# Altium project OpAmpDiffHSC.PRJPCB
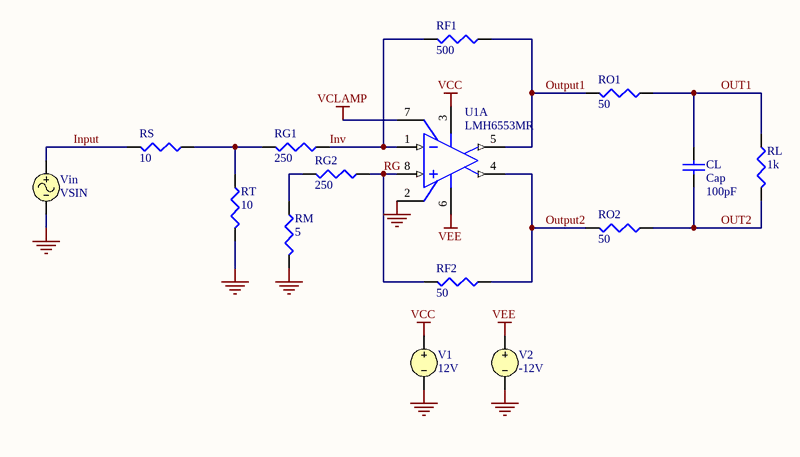
[diagram p0: OpAmpDiffHSC.schdoc]
1 sheet, 15 parts. Net scope: global (net labels, ports and power ports of the same name join across sheets).

## Sheet OpAmpDiffHSC.schdoc: Analog Amplifier
size A4; Organization: Altium Limited; Address1: L3, 12a Rodborough Rd; Address2: Frenchs Forest; Address3: NSW; Address4: Australia 2086; DocumentNumber: 1; SheetNumber: 1; SheetTotal: 1

### Parts
CL  Cap  value 100pF  [RAD-0.3]
RF1  value 500  (hidden comment: 100k)
RF2  value 50  (hidden comment: 100k)
RG1  value 250  (hidden comment: 10k)
RG2  value 250  (hidden comment: 10k)
RL  value 1k  (hidden comment: 25k)
RM  value 5  (hidden comment: 10k)
RO1  value 50  (hidden comment: 25k)
RO2  value 50  (hidden comment: 25k)
RS  value 10  (hidden comment: 10k)
RT  value 10  (hidden comment: 10k)
U1  LMH6553MR  [MRA08B_N]  (part A of 2)
V1  12V
V2  -12V
Vin  VSIN

### Nets
GND: RM.1(TOP) RT.1(TOP) U1.2(VCM) V1.2 V2.2 Vin.2
VCC: U1.3(V+) V1.1
VCLAMP: U1.7(VCLAMP)
VEE: U1.6(V-) V2.1
Input: RS.1(TOP) Vin.1
Inv: RF1.1(TOP) RG1.2(BOT) U1.1(IN-)
OUT1: CL.2 RL.2(BOT) RO1.2(BOT)
OUT2: CL.1 RL.1(TOP) RO2.2(BOT)
Output1: RF1.2(BOT) RO1.1(TOP) U1.5(OUT-)
Output2: RF2.2(BOT) RO2.1(TOP) U1.4(OUT+)
RG: RF2.1(TOP) RG2.2(BOT) U1.8(IN+)
NetRG1_1: RG1.1(TOP) RS.2(BOT) RT.2(BOT)
NetRG2_1: RG2.1(TOP) RM.2(BOT)

### Notes on the sheet
- Title
- Size:
- Date:
- A4
- Number:
- Time:
- Revision:
- Sheet
- of
- File:

### Library data of the parts
CL = Cap: Capacitor; Published: 8-Jun-2000; LatestRevisionDate: 17-Jul-2002; LatestRevisionNote: Re-released for DXP Platform.; PackageReference: RAD-0.3; Publisher: Altium Limited
RF1 RF2 RG1 RG2 RL RM RO1 RO2 RS RT = RES: Resistor
U1 = LMH6553MR: 900 MHz Fully Differential Amplifier with Output Limiting Clamp; Manufacturer: National Semiconductor; CompType: Amplifiers; PackageTopMarking: NSXYTT*LMH65*53MR; Published: 4-Dec-2008; DatasheetVersion: Sep-2008; PackageVersion: revB, Dec-2007; PackageReference: MRA08B; Publisher: Altium Limited; PackageDescription: Molded, PSOP .193 x .154 x .058in, 8 Lead, .050in Pitch, Large DAP; PartNumber: LMH6553; RoHS: Y; PinCount: 8; DigiKeyPartNumber: LMH6553MRE-ND; Code_JEDEC: MS-012-AA; ComponentLink1Description: LMH6553 Datasheet; ComponentLink1URL: http://www.national.com/ds/LM/LMH6553.pdf; ComponentLink2Description: LMH6553 Web Page; ComponentLink2URL: http://www.national.com/pf/LM/LMH6553.html; ComponentLink3Description: MRA08B Package Page; ComponentLink3URL: http://www.national.com/packaging/folders/mra08b.html; DeviceFunction: Differential Amplifier
V1 V2 = VSRC: Voltage Source
  V1: Value: 12V
  V2: Value: -12V
Vin = VSIN: Sinusoidal Voltage Source